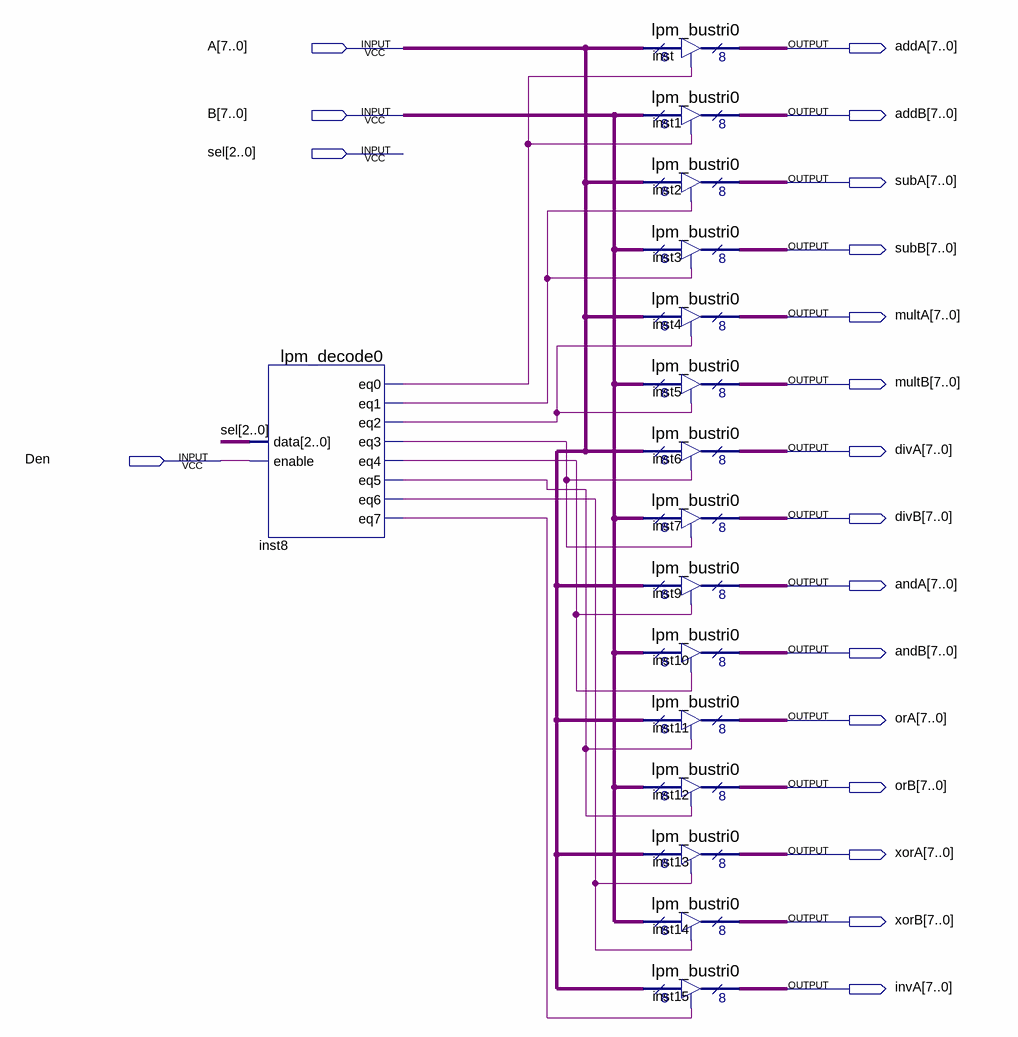
[diagram p0: schematic sheet]
// Quartus schematic gate.bdf as structural Verilog: 16 symbols, 19 pins
module gate (
  input  [7:0] A,
  input  [7:0] B,
  input  [2:0] sel,
  input  Den,
  output [7:0] addA,
  output [7:0] addB,
  output [7:0] subA,
  output [7:0] subB,
  output [7:0] multA,
  output [7:0] multB,
  output [7:0] divA,
  output [7:0] divB,
  output [7:0] andA,
  output [7:0] andB,
  output [7:0] orA,
  output [7:0] orB,
  output [7:0] xorA,
  output [7:0] xorB,
  output [7:0] invA
);

  wire inst8_eq0, inst8_eq1, inst8_eq2, inst8_eq3, inst8_eq4, inst8_eq5, inst8_eq6, inst8_eq7;

  lpm_decode0 inst8 (
    .data(sel), .enable(Den), .eq0(inst8_eq0), .eq1(inst8_eq1), .eq2(inst8_eq2), .eq3(inst8_eq3),
    .eq4(inst8_eq4), .eq5(inst8_eq5), .eq6(inst8_eq6), .eq7(inst8_eq7));
  lpm_bustri0 inst (.enabledt(inst8_eq0), .data(A), .tridata(addA));
  lpm_bustri0 inst1 (.enabledt(inst8_eq0), .data(B), .tridata(addB));
  lpm_bustri0 inst2 (.enabledt(inst8_eq1), .data(A), .tridata(subA));
  lpm_bustri0 inst3 (.enabledt(inst8_eq1), .data(B), .tridata(subB));
  lpm_bustri0 inst4 (.enabledt(inst8_eq2), .data(A), .tridata(multA));
  lpm_bustri0 inst5 (.enabledt(inst8_eq2), .data(B), .tridata(multB));
  lpm_bustri0 inst6 (.enabledt(inst8_eq3), .data(A), .tridata(divA));
  lpm_bustri0 inst7 (.enabledt(inst8_eq3), .data(B), .tridata(divB));
  lpm_bustri0 inst9 (.enabledt(inst8_eq4), .data(A), .tridata(andA));
  lpm_bustri0 inst10 (.enabledt(inst8_eq4), .data(B), .tridata(andB));
  lpm_bustri0 inst11 (.enabledt(inst8_eq5), .data(A), .tridata(orA));
  lpm_bustri0 inst12 (.enabledt(inst8_eq5), .data(B), .tridata(orB));
  lpm_bustri0 inst13 (.enabledt(inst8_eq6), .data(A), .tridata(xorA));
  lpm_bustri0 inst14 (.enabledt(inst8_eq6), .data(B), .tridata(xorB));
  lpm_bustri0 inst15 (.enabledt(inst8_eq7), .data(A), .tridata(invA));
endmodule
